# EAGLE design PGTNX05_mainboard (EAGLE 8.5.2)
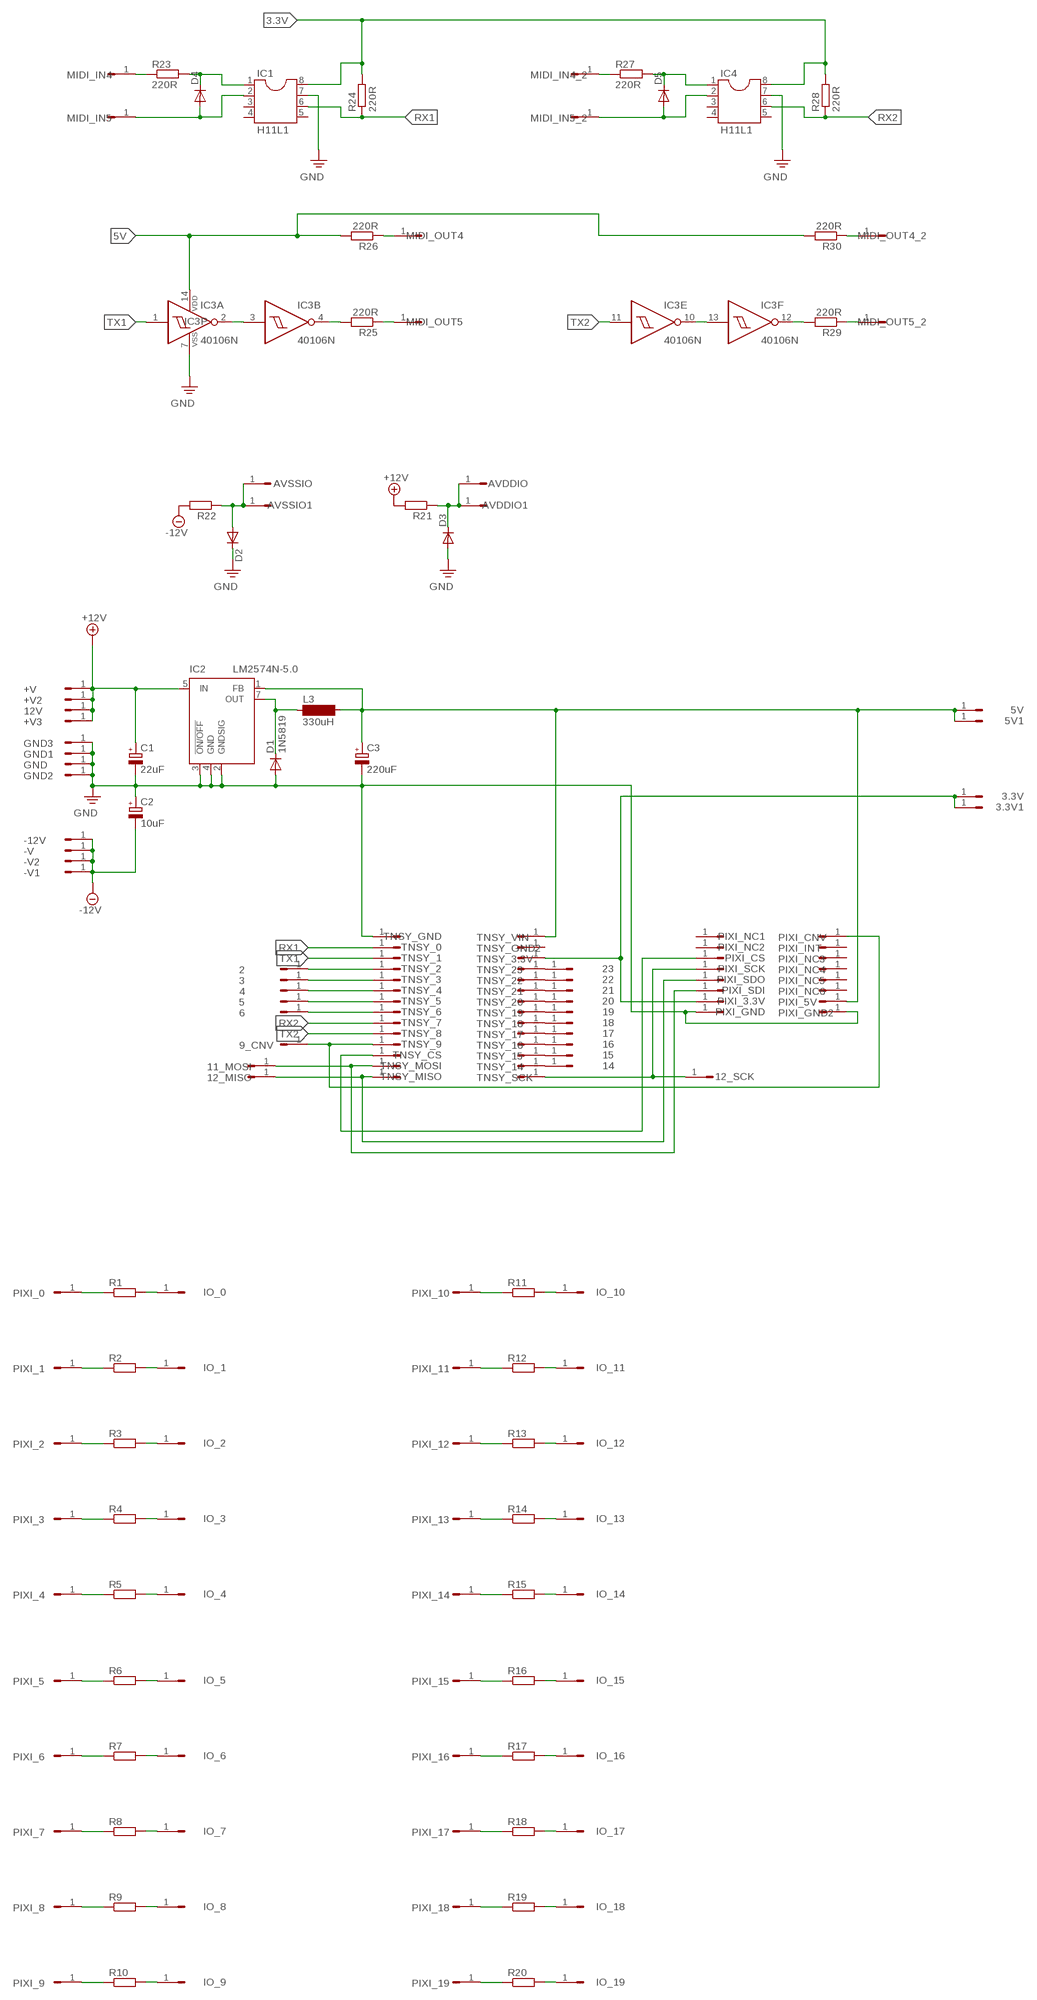
[diagram p0: schematic, sheet 1]

## Parts
2  HEADER/MALE/01  [HEADER/MALE/01]
3  HEADER/MALE/01  [HEADER/MALE/01]
3.3V  HEADER/MALE/01  [HEADER/MALE/01]
3.3V1  HEADER/MALE/01  [HEADER/MALE/01]
4  HEADER/MALE/01  [HEADER/MALE/01]
5  HEADER/MALE/01  [HEADER/MALE/01]
5V  HEADER/MALE/01  [HEADER/MALE/01]
5V1  HEADER/MALE/01  [HEADER/MALE/01]
6  HEADER/MALE/01  [HEADER/MALE/01]
9_CNV  HEADER/MALE/01  [HEADER/MALE/01]
11_MOSI  HEADER/MALE/01  [HEADER/MALE/01]
12_MISO  HEADER/MALE/01  [HEADER/MALE/01]
12_SCK  HEADER/MALE/01  [HEADER/MALE/01]
12V  HEADER/MALE/01  [HEADER/MALE/01]
14  HEADER/MALE/01  [HEADER/MALE/01]
15  HEADER/MALE/01  [HEADER/MALE/01]
16  HEADER/MALE/01  [HEADER/MALE/01]
17  HEADER/MALE/01  [HEADER/MALE/01]
18  HEADER/MALE/01  [HEADER/MALE/01]
19  HEADER/MALE/01  [HEADER/MALE/01]
20  HEADER/MALE/01  [HEADER/MALE/01]
21  HEADER/MALE/01  [HEADER/MALE/01]
22  HEADER/MALE/01  [HEADER/MALE/01]
23  HEADER/MALE/01  [HEADER/MALE/01]
+V  HEADER/MALE/01  [HEADER/MALE/01]
+V2  HEADER/MALE/01  [HEADER/MALE/01]
+V3  HEADER/MALE/01  [HEADER/MALE/01]
-12V  HEADER/MALE/01  [HEADER/MALE/01]
-V  HEADER/MALE/01  [HEADER/MALE/01]
-V1  HEADER/MALE/01  [HEADER/MALE/01]
-V2  HEADER/MALE/01  [HEADER/MALE/01]
AVDDIO  HEADER/MALE/01  [HEADER/MALE/01]
AVDDIO1  HEADER/MALE/01  [HEADER/MALE/01]
AVSSIO  HEADER/MALE/01  [HEADER/MALE/01]
AVSSIO1  HEADER/MALE/01  [HEADER/MALE/01]
C1  22uF  CAPACITOR/POLARIZEDE5-10.5  [E5-10,5]
C2  10uF  CAPACITOR/POLARIZEDE2.5-6  [E2,5-6]
C3  220uF  CAPACITOR/POLARIZEDE2.5-6  [E2,5-6]
D1  1N5819  1N4148DO35-7  [DO35-7]
D2  1N4148DO35-7  [DO35-7]
D3  1N4148DO35-7  [DO35-7]
D4  1N4148DO35-7  [DO35-7]
D5  1N4148DO35-7  [DO35-7]
GND  HEADER/MALE/01  [HEADER/MALE/01]
GND1  HEADER/MALE/01  [HEADER/MALE/01]
GND2  HEADER/MALE/01  [HEADER/MALE/01]
GND3  HEADER/MALE/01  [HEADER/MALE/01]
IC1  H11L1  DIL8  [DIL08]
IC2  LM2574N-5.0  [DIL08]
IC3  40106N  [DIL14]
IC4  H11L1  DIL8  [DIL08]
IO_0  HEADER/MALE/01  [HEADER/MALE/01]
IO_1  HEADER/MALE/01  [HEADER/MALE/01]
IO_2  HEADER/MALE/01  [HEADER/MALE/01]
IO_3  HEADER/MALE/01  [HEADER/MALE/01]
IO_4  HEADER/MALE/01  [HEADER/MALE/01]
IO_5  HEADER/MALE/01  [HEADER/MALE/01]
IO_6  HEADER/MALE/01  [HEADER/MALE/01]
IO_7  HEADER/MALE/01  [HEADER/MALE/01]
IO_8  HEADER/MALE/01  [HEADER/MALE/01]
IO_9  HEADER/MALE/01  [HEADER/MALE/01]
IO_10  HEADER/MALE/01  [HEADER/MALE/01]
IO_11  HEADER/MALE/01  [HEADER/MALE/01]
IO_12  HEADER/MALE/01  [HEADER/MALE/01]
IO_13  HEADER/MALE/01  [HEADER/MALE/01]
IO_14  HEADER/MALE/01  [HEADER/MALE/01]
IO_15  HEADER/MALE/01  [HEADER/MALE/01]
IO_16  HEADER/MALE/01  [HEADER/MALE/01]
IO_17  HEADER/MALE/01  [HEADER/MALE/01]
IO_18  HEADER/MALE/01  [HEADER/MALE/01]
IO_19  HEADER/MALE/01  [HEADER/MALE/01]
L3  330uH  BS11  [BS11]
MIDI_IN4  HEADER/MALE/01  [HEADER/MALE/01]
MIDI_IN4_2  HEADER/MALE/01  [HEADER/MALE/01]
MIDI_IN5  HEADER/MALE/01  [HEADER/MALE/01]
MIDI_IN5_2  HEADER/MALE/01  [HEADER/MALE/01]
MIDI_OUT4  HEADER/MALE/01  [HEADER/MALE/01]
MIDI_OUT4_2  HEADER/MALE/01  [HEADER/MALE/01]
MIDI_OUT5  HEADER/MALE/01  [HEADER/MALE/01]
MIDI_OUT5_2  HEADER/MALE/01  [HEADER/MALE/01]
PIXI_0  HEADER/MALE/01  [HEADER/MALE/01]
PIXI_1  HEADER/MALE/01  [HEADER/MALE/01]
PIXI_2  HEADER/MALE/01  [HEADER/MALE/01]
PIXI_3  HEADER/MALE/01  [HEADER/MALE/01]
PIXI_3.3V  HEADER/MALE/01  [HEADER/MALE/01]
PIXI_4  HEADER/MALE/01  [HEADER/MALE/01]
PIXI_5  HEADER/MALE/01  [HEADER/MALE/01]
PIXI_5V  HEADER/MALE/01  [HEADER/MALE/01]
PIXI_6  HEADER/MALE/01  [HEADER/MALE/01]
PIXI_7  HEADER/MALE/01  [HEADER/MALE/01]
PIXI_8  HEADER/MALE/01  [HEADER/MALE/01]
PIXI_9  HEADER/MALE/01  [HEADER/MALE/01]
PIXI_10  HEADER/MALE/01  [HEADER/MALE/01]
PIXI_11  HEADER/MALE/01  [HEADER/MALE/01]
PIXI_12  HEADER/MALE/01  [HEADER/MALE/01]
PIXI_13  HEADER/MALE/01  [HEADER/MALE/01]
PIXI_14  HEADER/MALE/01  [HEADER/MALE/01]
PIXI_15  HEADER/MALE/01  [HEADER/MALE/01]
PIXI_16  HEADER/MALE/01  [HEADER/MALE/01]
PIXI_17  HEADER/MALE/01  [HEADER/MALE/01]
PIXI_18  HEADER/MALE/01  [HEADER/MALE/01]
PIXI_19  HEADER/MALE/01  [HEADER/MALE/01]
PIXI_CNV  HEADER/MALE/01  [HEADER/MALE/01]
PIXI_CS  HEADER/MALE/01  [HEADER/MALE/01]
PIXI_GND  HEADER/MALE/01  [HEADER/MALE/01]
PIXI_GND2  HEADER/MALE/01  [HEADER/MALE/01]
PIXI_INT  HEADER/MALE/01  [HEADER/MALE/01]
PIXI_NC1  HEADER/MALE/01  [HEADER/MALE/01]
PIXI_NC2  HEADER/MALE/01  [HEADER/MALE/01]
PIXI_NC3  HEADER/MALE/01  [HEADER/MALE/01]
PIXI_NC4  HEADER/MALE/01  [HEADER/MALE/01]
PIXI_NC5  HEADER/MALE/01  [HEADER/MALE/01]
PIXI_NC6  HEADER/MALE/01  [HEADER/MALE/01]
PIXI_SCK  HEADER/MALE/01  [HEADER/MALE/01]
PIXI_SDI  HEADER/MALE/01  [HEADER/MALE/01]
PIXI_SDO  HEADER/MALE/01  [HEADER/MALE/01]
R1  RESISTORRESISTOR/UPRIGHT/7.5  [RESISTOR/7.5]
R2  RESISTORRESISTOR/UPRIGHT/7.5  [RESISTOR/7.5]
R3  RESISTORRESISTOR/UPRIGHT/7.5  [RESISTOR/7.5]
R4  RESISTORRESISTOR/UPRIGHT/7.5  [RESISTOR/7.5]
R5  RESISTORRESISTOR/UPRIGHT/7.5  [RESISTOR/7.5]
R6  RESISTORRESISTOR/UPRIGHT/7.5  [RESISTOR/7.5]
R7  RESISTORRESISTOR/UPRIGHT/7.5  [RESISTOR/7.5]
R8  RESISTORRESISTOR/UPRIGHT/7.5  [RESISTOR/7.5]
R9  RESISTORRESISTOR/UPRIGHT/7.5  [RESISTOR/7.5]
R10  RESISTORRESISTOR/UPRIGHT/7.5  [RESISTOR/7.5]
R11  RESISTORRESISTOR/UPRIGHT/7.5  [RESISTOR/7.5]
R12  RESISTORRESISTOR/UPRIGHT/7.5  [RESISTOR/7.5]
R13  RESISTORRESISTOR/UPRIGHT/7.5  [RESISTOR/7.5]
R14  RESISTORRESISTOR/UPRIGHT/7.5  [RESISTOR/7.5]
R15  RESISTORRESISTOR/UPRIGHT/7.5  [RESISTOR/7.5]
R16  RESISTORRESISTOR/UPRIGHT/7.5  [RESISTOR/7.5]
R17  RESISTORRESISTOR/UPRIGHT/7.5  [RESISTOR/7.5]
R18  RESISTORRESISTOR/UPRIGHT/7.5  [RESISTOR/7.5]
R19  RESISTORRESISTOR/UPRIGHT/7.5  [RESISTOR/7.5]
R20  RESISTORRESISTOR/UPRIGHT/7.5  [RESISTOR/7.5]
R21  RESISTORRESISTOR/UPRIGHT/7.5  [RESISTOR/7.5]
R22  RESISTORRESISTOR/UPRIGHT/7.5  [RESISTOR/7.5]
R23  220R  RESISTORRESISTOR/UPRIGHT/7.5  [RESISTOR/7.5]
R24  220R  RESISTORRESISTOR/UPRIGHT/7.5  [RESISTOR/7.5]
R25  220R  RESISTORRESISTOR/UPRIGHT/7.5  [RESISTOR/7.5]
R26  220R  RESISTORRESISTOR/UPRIGHT/7.5  [RESISTOR/7.5]
R27  220R  RESISTORRESISTOR/UPRIGHT/7.5  [RESISTOR/7.5]
R28  220R  RESISTORRESISTOR/UPRIGHT/7.5  [RESISTOR/7.5]
R29  220R  RESISTORRESISTOR/UPRIGHT/7.5  [RESISTOR/7.5]
R30  220R  RESISTORRESISTOR/UPRIGHT/7.5  [RESISTOR/7.5]
TNSY_0  HEADER/MALE/01  [HEADER/MALE/01]
TNSY_1  HEADER/MALE/01  [HEADER/MALE/01]
TNSY_2  HEADER/MALE/01  [HEADER/MALE/01]
TNSY_3  HEADER/MALE/01  [HEADER/MALE/01]
TNSY_3.3V  HEADER/MALE/01  [HEADER/MALE/01]
TNSY_4  HEADER/MALE/01  [HEADER/MALE/01]
TNSY_5  HEADER/MALE/01  [HEADER/MALE/01]
TNSY_6  HEADER/MALE/01  [HEADER/MALE/01]
TNSY_7  HEADER/MALE/01  [HEADER/MALE/01]
TNSY_8  HEADER/MALE/01  [HEADER/MALE/01]
TNSY_9  HEADER/MALE/01  [HEADER/MALE/01]
TNSY_14  HEADER/MALE/01  [HEADER/MALE/01]
TNSY_15  HEADER/MALE/01  [HEADER/MALE/01]
TNSY_16  HEADER/MALE/01  [HEADER/MALE/01]
TNSY_17  HEADER/MALE/01  [HEADER/MALE/01]
TNSY_18  HEADER/MALE/01  [HEADER/MALE/01]
TNSY_19  HEADER/MALE/01  [HEADER/MALE/01]
TNSY_20  HEADER/MALE/01  [HEADER/MALE/01]
TNSY_21  HEADER/MALE/01  [HEADER/MALE/01]
TNSY_22  HEADER/MALE/01  [HEADER/MALE/01]
TNSY_23  HEADER/MALE/01  [HEADER/MALE/01]
TNSY_CS  HEADER/MALE/01  [HEADER/MALE/01]
TNSY_GND  HEADER/MALE/01  [HEADER/MALE/01]
TNSY_GND2  HEADER/MALE/01  [HEADER/MALE/01]
TNSY_MISO  HEADER/MALE/01  [HEADER/MALE/01]
TNSY_MOSI  HEADER/MALE/01  [HEADER/MALE/01]
TNSY_SCK  HEADER/MALE/01  [HEADER/MALE/01]
TNSY_VIN  HEADER/MALE/01  [HEADER/MALE/01]

## Nets
3.3V: 3.3V1.1 3.3V.1 IC1.8 IC4.8 PIXI_3.3V.1 R24.2 R28.2 TNSY_3.3V.1
5V: 5V1.1 5V.1 C3.+ IC2.1(FB) IC3.14(P:VDD) L3.2 PIXI_5V.1 R26.2 R30.2 TNSY_VIN.1
+12V: 12V.1 +V2.1 +V3.1 +V.1 C1.+ IC2.5(IN) R21.2
-12V: -12V.1 -V1.1 -V2.1 -V.1 C2.- R22.2
GND: C1.- C2.+ C3.- D1.A D2.C D3.A GND1.1 GND2.1 GND3.1 GND.1 IC1.7 IC2.2(GNDSIG) IC2.3(!ON/OFF) IC2.4(GND) IC3.7(P:VSS) IC4.7 PIXI_GND2.1 PIXI_GND.1 TNSY_GND.1
N$2: 17.1 TNSY_17.1
N$4: 16.1 TNSY_16.1
N$5: D1.C IC2.7(OUT) L3.1
N$6: 12_MISO.1 PIXI_SDO.1 TNSY_MISO.1
N$8: PIXI_CS.1 TNSY_CS.1
N$11: 18.1 TNSY_18.1
N$12: 19.1 TNSY_19.1
N$13: 20.1 TNSY_20.1
N$14: 21.1 TNSY_21.1
N$15: 22.1 TNSY_22.1
N$16: 23.1 TNSY_23.1
N$18: 15.1 TNSY_15.1
N$19: 2.1 TNSY_2.1
N$20: 3.1 TNSY_3.1
N$21: 4.1 TNSY_4.1
N$22: 5.1 TNSY_5.1
N$23: PIXI_0.1 R1.1
N$24: IO_0.1 R1.2
N$25: PIXI_1.1 R2.1
N$26: 6.1 TNSY_6.1
N$27: IO_1.1 R2.2
N$28: 9_CNV.1 PIXI_CNV.1 TNSY_9.1
N$29: 11_MOSI.1 PIXI_SDI.1 TNSY_MOSI.1
N$30: PIXI_2.1 R3.1
N$31: 12_SCK.1 PIXI_SCK.1 TNSY_SCK.1
N$32: 14.1 TNSY_14.1
N$33: IO_2.1 R3.2
N$34: PIXI_3.1 R4.1
N$35: IO_3.1 R4.2
N$36: PIXI_4.1 R5.1
N$37: IO_4.1 R5.2
N$38: PIXI_5.1 R6.1
N$39: IO_5.1 R6.2
N$40: PIXI_6.1 R7.1
N$41: IO_6.1 R7.2
N$42: PIXI_7.1 R8.1
N$43: IO_7.1 R8.2
N$44: PIXI_8.1 R9.1
N$45: IO_8.1 R9.2
N$46: PIXI_9.1 R10.1
N$47: IO_9.1 R10.2
N$48: PIXI_10.1 R11.1
N$49: IO_10.1 R11.2
N$50: PIXI_11.1 R12.1
N$51: IO_11.1 R12.2
N$52: PIXI_12.1 R13.1
N$53: IO_12.1 R13.2
N$54: PIXI_13.1 R14.1
N$55: IO_13.1 R14.2
N$56: PIXI_14.1 R15.1
N$57: IO_14.1 R15.2
N$58: PIXI_15.1 R16.1
N$59: IO_15.1 R16.2
N$60: PIXI_16.1 R17.1
N$61: IO_16.1 R17.2
N$62: PIXI_17.1 R18.1
N$63: IO_17.1 R18.2
N$64: PIXI_18.1 R19.1
N$65: IO_18.1 R19.2
N$66: AVDDIO1.1 AVDDIO.1 D3.C R21.1
N$67: AVSSIO1.1 AVSSIO.1 D2.A R22.1
N$68: PIXI_19.1 R20.1
N$69: IO_19.1 R20.2
N$70: MIDI_IN4.1 R23.1
N$71: D4.C IC1.1 R23.2
N$72: D4.A IC1.2 MIDI_IN5.1
N$75: IC3.2(A:O) IC3.3(B:I)
N$76: IC3.4(B:O) R25.2
N$77: MIDI_OUT5.1 R25.1
N$78: MIDI_OUT4.1 R26.1
N$79: MIDI_IN4_2.1 R27.1
N$80: D5.C IC4.1 R27.2
N$81: D5.A IC4.2 MIDI_IN5_2.1
N$85: IC3.10(E:O) IC3.13(F:I)
N$86: IC3.12(F:O) R29.2
N$87: MIDI_OUT5_2.1 R29.1
N$89: MIDI_OUT4_2.1 R30.1
RX1: IC1.6 R24.1 TNSY_0.1
RX2: IC4.6 R28.1 TNSY_7.1
TX1: IC3.1(A:I) TNSY_1.1
TX2: IC3.11(E:I) TNSY_8.1
Unconnected: IC1.3 IC1.4 IC1.5 IC3.5(C:I) IC3.6(C:O) IC3.8(D:O) IC3.9(D:I) IC4.3 IC4.4 IC4.5 PIXI_INT.1 PIXI_NC1.1 PIXI_NC2.1 PIXI_NC3.1 PIXI_NC4.1 PIXI_NC5.1 PIXI_NC6.1 TNSY_GND2.1

## Library data of the parts
2 3 3.3V 3.3V1 4 5 5V 5V1 6 9_CNV 11_MOSI 12_MISO 12_SCK 12V 14-23 +V +V2 +V3 -12V -V -V1 -V2 AVDDIO AVDDIO1 AVSSIO AVSSIO1 GND GND1-GND3 IO_0 IO_1-IO_19 MIDI_IN4 MIDI_IN4_2 MIDI_IN5 MIDI_IN5_2 MIDI_OUT4 MIDI_OUT4_2 MIDI_OUT5 MIDI_OUT5_2 PIXI_0 PIXI_1-PIXI_3 PIXI_3.3V PIXI_4 PIXI_5 PIXI_5V PIXI_6-PIXI_19 PIXI_CNV PIXI_CS PIXI_GND PIXI_GND2 PIXI_INT PIXI_NC1-PIXI_NC6 PIXI_SCK PIXI_SDI PIXI_SDO TNSY_0 TNSY_1-TNSY_3 TNSY_3.3V TNSY_4-TNSY_9 TNSY_14-TNSY_23 TNSY_CS TNSY_GND TNSY_GND2 TNSY_MISO TNSY_MOSI TNSY_SCK TNSY_VIN = connectors:HEADER/MALE/01; SPICEPREFIX: X
C1-C3 = capacitors:CAPACITOR/POLARIZED: POLARIZED CAPACITOR, European symbol; SPICEPREFIX: C
D1-D5 = transistors:1N4148: DIODE high speed (Philips)
IC1 IC4 = ic_package:DIL8: Dual In Line / Socket
IC2 = linear:LM2574?-*: SIMPLE SWITCHER 0.5A Step-Down Voltage Regulator Source: http://cache.national.com/ds/LM/LM2574.pdf
IC3 = 40xx:40106: Hex SCHMITT TRIGGER
L3 = inductor-neosid:BS: INDUCTOR nominal inductance, magnetically screened; OC_FARNELL: unknown; OC_NEWARK: unknown
R1-R30 = resistors:RESISTOR: RESISTOR, European symbol

## Board
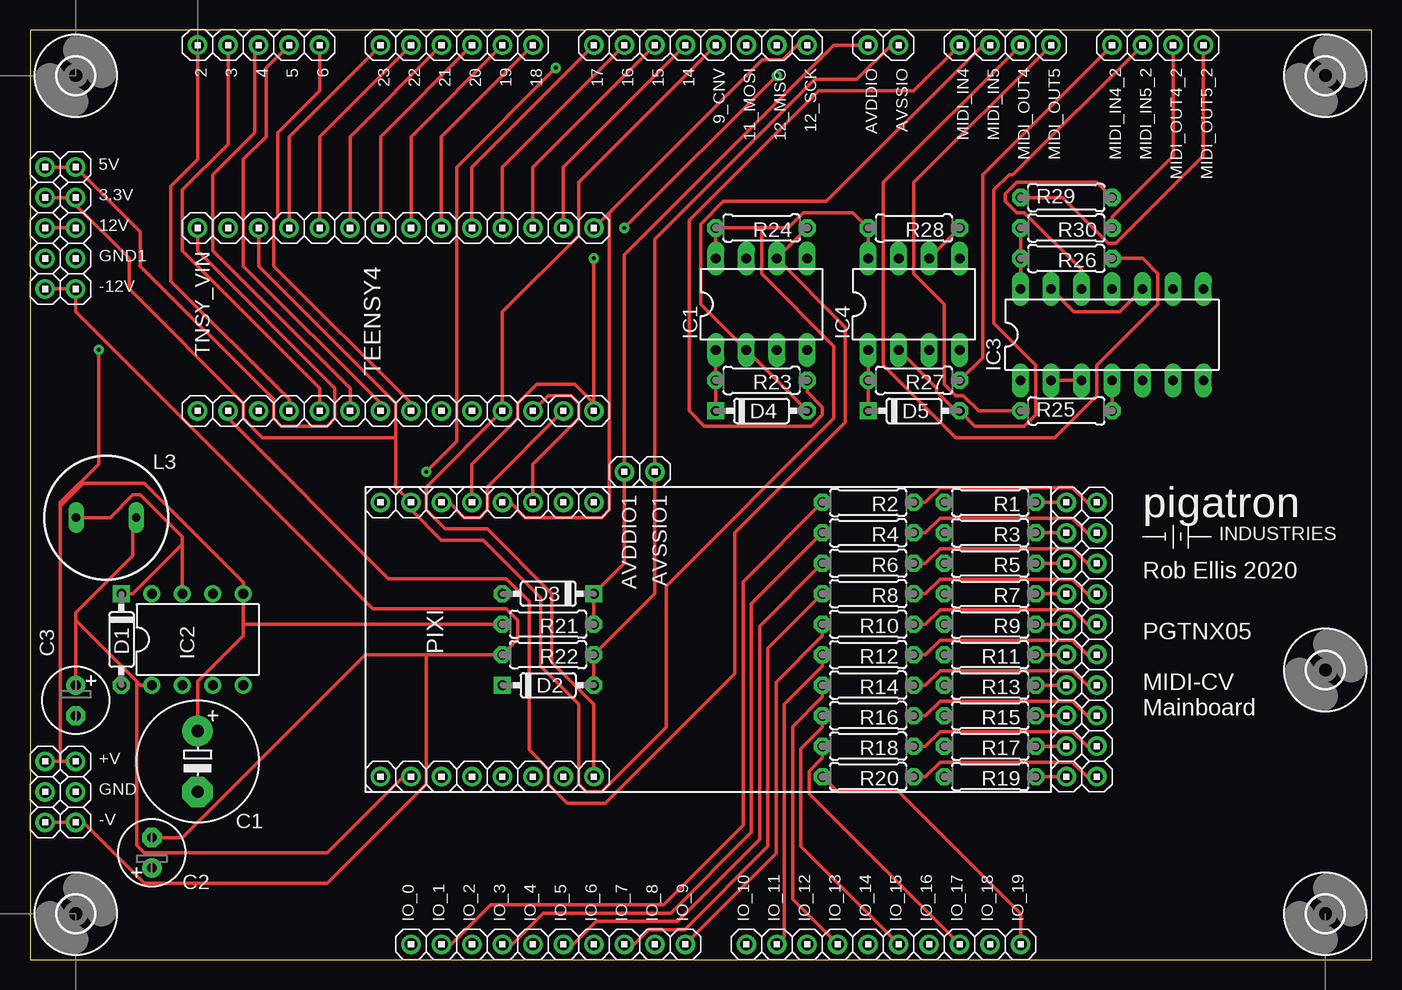
[diagram p1: board, top side]
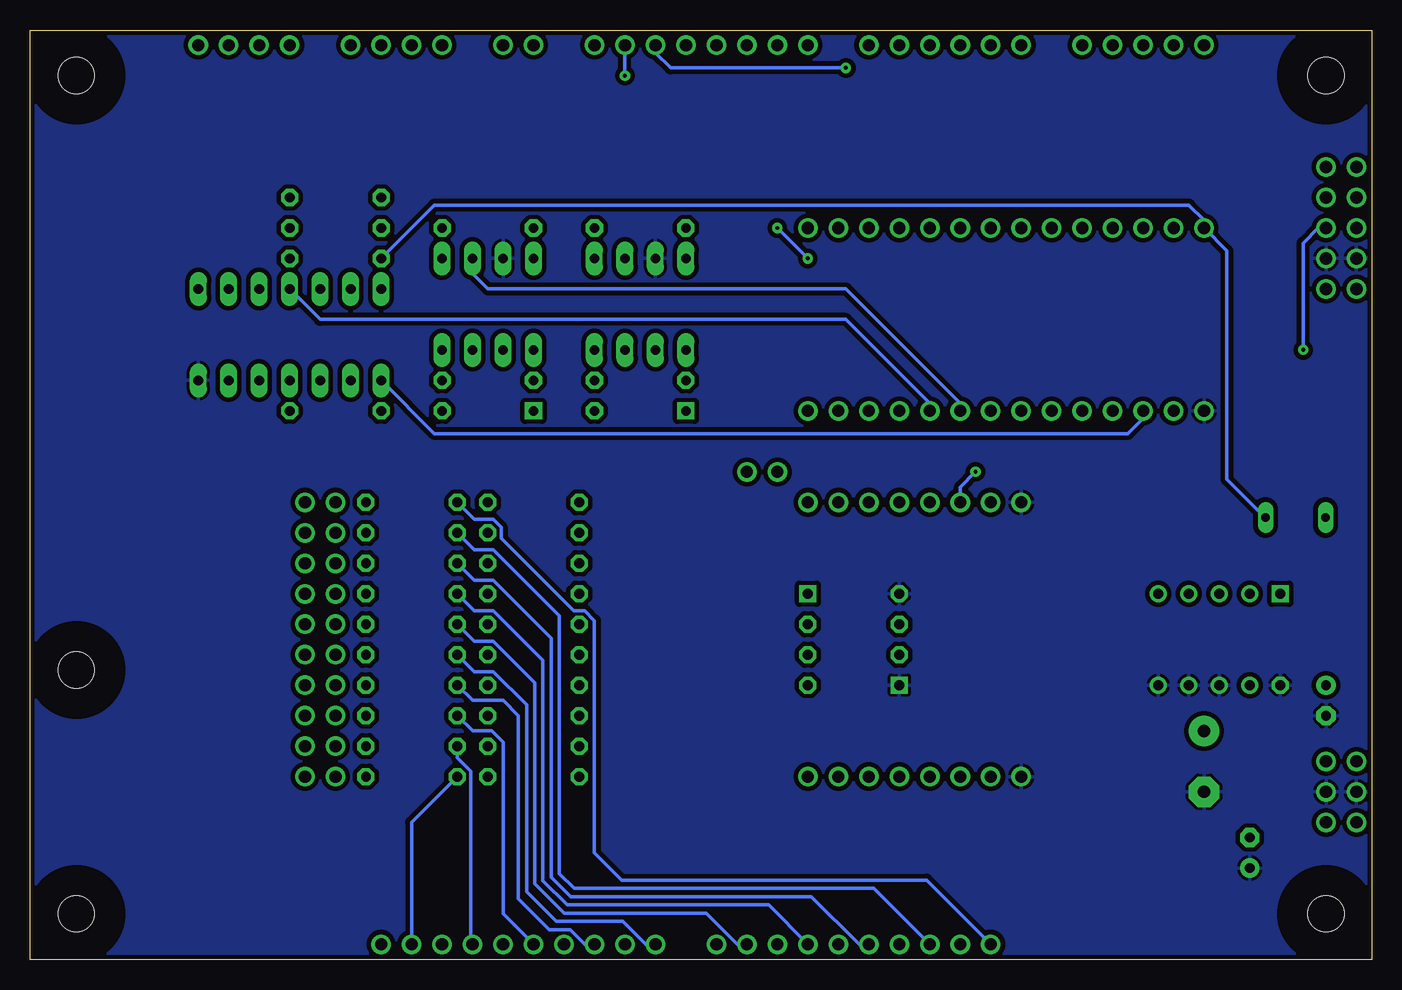
[diagram p2: board, bottom side, seen from below]

Size 111.81 x 77.46 mm. Coordinates in mm from the lower left corner, seen from the top.
Outline: 0,0 111.81,0 111.81,77.46 0,77.46 0,0
Copper layers (1*16): Top 0.0356mm / dielectric 1.5011mm / Bottom 0.0356mm
Design rules "pigatron": minimum track width 12mil, minimum drill 13mil, track to track 15mil, track to pad 10mil, pad to pad 10mil, via to via 10mil, smd to smd 6mil, copper to edge 15mil, drill to drill 10mil, minimum pad ring 12mil, minimum via ring 10mil, stop-mask expansion 4mil, vias tented up to drill 0mil, thermal gap 10mil

### Footprints (pad centres in the part's own frame; a part is rotated, then mirrored left to right if it is on the bottom)
HEADER/MALE/01 = drill 1.016: 1 0,0
E5-10,5 = drill 1.016 pad 2.54: + -2.54,0 | drill 1.016 pad 2.54 octagon: - 2.54,0
E2,5-6 = drill 0.813 pad 1.6: + -1.27,0 | drill 0.813 pad 1.6 octagon: - 1.27,0
DO35-7 = drill 0.813 octagon: A 3.81,0 | drill 0.813 square: C -3.81,0
DIL08 = drill 0.813 long: 1 -3.81,-3.81; 2 -1.27,-3.81; 3 1.27,-3.81; 4 3.81,-3.81; 5 3.81,3.81; 6 1.27,3.81; 7 -1.27,3.81; 8 -3.81,3.81
DIL08' = drill 0.813 pad 1.27: 1 -3.81,-3.81; 2 -1.27,-3.81; 3 1.27,-3.81; 4 3.81,-3.81; 5 3.81,3.81; 6 1.27,3.81; 7 -1.27,3.81; 8 -3.81,3.81
DIL14 = drill 0.813 long: 1 -7.62,-3.81; 2 -5.08,-3.81; 3 -2.54,-3.81; 4 0,-3.81; 5 2.54,-3.81; 6 5.08,-3.81; 7 7.62,-3.81; 8 7.62,3.81; 9 5.08,3.81; 10 2.54,3.81; 11 0,3.81; 12 -2.54,3.81; 13 -5.08,3.81; 14 -7.62,3.81
BS11 = drill 0.7 long: 1 -2.5,0; 2 2.5,0
RESISTOR/7.5 = drill 0.813 octagon: 1 -3.81,0; 2 3.81,0
STANDOFF/3.0 = hole 3: 0,0

### Placement (x,y rotation side)
2  13.97,76.2 270 top
3  16.51,76.2 270 top
3.3V  3.81,63.5 0 top
3.3V1  1.27,63.5 0 top
4  19.05,76.2 270 top
5  21.59,76.2 270 top
5V  3.81,66.04 0 top
5V1  1.27,66.04 0 top
6  24.13,76.2 270 top
9_CNV  57.15,76.2 270 top
11_MOSI  59.69,76.2 270 top
12_MISO  62.23,76.2 270 top
12_SCK  64.77,76.2 270 top
12V  3.81,60.96 0 top
14  54.61,76.2 270 top
15  52.07,76.2 270 top
16  49.53,76.2 270 top
17  46.99,76.2 270 top
18  41.91,76.2 270 top
19  39.37,76.2 270 top
20  36.83,76.2 270 top
21  34.29,76.2 270 top
22  31.75,76.2 270 top
23  29.21,76.2 270 top
+V  3.81,16.51 0 top
+V2  1.27,16.51 0 top
+V3  1.27,60.96 0 top
-12V  3.81,55.88 0 top
-V  3.81,11.43 0 top
-V1  1.27,55.88 0 top
-V2  1.27,11.43 0 top
AVDDIO  69.85,76.2 270 top
AVDDIO1  49.53,40.64 270 top
AVSSIO  72.39,76.2 270 top
AVSSIO1  52.07,40.64 270 top
C1  13.97,16.51 270 top
C2  10.16,8.89 90 top
C3  3.81,21.59 270 top
D1  7.62,26.67 270 top
D2  43.18,22.86 0 top
D3  43.18,30.48 180 top
D4  60.96,45.72 0 top
D5  73.66,45.72 0 top
GND  3.81,13.97 0 top
GND1  3.81,58.42 0 top
GND2  1.27,13.97 0 top
GND3  1.27,58.42 0 top
IC1  60.96,54.61 0 top
IC2  LM2574N-5.0  [DIL08']  13.97,26.67 0 top
IC3  90.17,52.07 0 top
IC4  73.66,54.61 0 top
IO_0  31.75,1.27 90 top
IO_1  34.29,1.27 90 top
IO_2  36.83,1.27 90 top
IO_3  39.37,1.27 90 top
IO_4  41.91,1.27 90 top
IO_5  44.45,1.27 90 top
IO_6  46.99,1.27 90 top
IO_7  49.53,1.27 90 top
IO_8  52.07,1.27 90 top
IO_9  54.61,1.27 90 top
IO_10  59.69,1.27 90 top
IO_11  62.23,1.27 90 top
IO_12  64.77,1.27 90 top
IO_13  67.31,1.27 90 top
IO_14  69.85,1.27 90 top
IO_15  72.39,1.27 90 top
IO_16  74.93,1.27 90 top
IO_17  77.47,1.27 90 top
IO_18  80.01,1.27 90 top
IO_19  82.55,1.27 90 top
L3  6.35,36.83 0 top
MIDI_IN4  77.47,76.2 270 top
MIDI_IN4_2  90.17,76.2 270 top
MIDI_IN5  80.01,76.2 270 top
MIDI_IN5_2  92.71,76.2 270 top
MIDI_OUT4  82.55,76.2 270 top
MIDI_OUT4_2  95.25,76.2 270 top
MIDI_OUT5  85.09,76.2 270 top
MIDI_OUT5_2  97.79,76.2 270 top
PIXI_0  86.36,38.1 180 top
PIXI_1  88.9,38.1 0 top
PIXI_2  86.36,35.56 180 top
PIXI_3  88.9,35.56 0 top
PIXI_3.3V  31.75,38.1 270 top
PIXI_4  86.36,33.02 180 top
PIXI_5  88.9,33.02 0 top
PIXI_5V  31.75,15.24 90 top
PIXI_6  86.36,30.48 180 top
PIXI_7  88.9,30.48 0 top
PIXI_8  86.36,27.94 180 top
PIXI_9  88.9,27.94 0 top
PIXI_10  86.36,25.4 180 top
PIXI_11  88.9,25.4 0 top
PIXI_12  86.36,22.86 180 top
PIXI_13  88.9,22.86 0 top
PIXI_14  86.36,20.32 180 top
PIXI_15  88.9,20.32 0 top
PIXI_16  86.36,17.78 180 top
PIXI_17  88.9,17.78 0 top
PIXI_18  86.36,15.24 180 top
PIXI_19  88.9,15.24 0 top
PIXI_CNV  46.99,15.24 90 top
PIXI_CS  41.91,38.1 270 top
PIXI_GND  29.21,38.1 270 top
PIXI_GND2  29.21,15.24 90 top
PIXI_INT  44.45,15.24 90 top
PIXI_NC1  46.99,38.1 270 top
PIXI_NC2  44.45,38.1 270 top
PIXI_NC3  41.91,15.24 90 top
PIXI_NC4  39.37,15.24 90 top
PIXI_NC5  36.83,15.24 90 top
PIXI_NC6  34.29,15.24 90 top
PIXI_SCK  39.37,38.1 270 top
PIXI_SDI  34.29,38.1 270 top
PIXI_SDO  36.83,38.1 270 top
R1  80.01,38.1 180 top
R2  69.85,38.1 180 top
R3  80.01,35.56 180 top
R4  69.85,35.56 180 top
R5  80.01,33.02 180 top
R6  69.85,33.02 180 top
R7  80.01,30.48 180 top
R8  69.85,30.48 180 top
R9  80.01,27.94 180 top
R10  69.85,27.94 180 top
R11  80.01,25.4 180 top
R12  69.85,25.4 180 top
R13  80.01,22.86 180 top
R14  69.85,22.86 180 top
R15  80.01,20.32 180 top
R16  69.85,20.32 180 top
R17  80.01,17.78 180 top
R18  69.85,17.78 180 top
R19  80.01,15.24 180 top
R20  69.85,15.24 180 top
R21  43.18,27.94 180 top
R22  43.18,25.4 180 top
R23  60.96,48.26 180 top
R24  60.96,60.96 180 top
R25  86.36,45.72 0 top
R26  86.36,58.42 180 top
R27  73.66,48.26 180 top
R28  73.66,60.96 180 top
R29  86.36,63.5 0 top
R30  86.36,60.96 180 top
TNSY_0  16.51,45.72 90 top
TNSY_1  19.05,45.72 90 top
TNSY_2  21.59,45.72 90 top
TNSY_3  24.13,45.72 90 top
TNSY_3.3V  19.05,60.96 90 top
TNSY_4  26.67,45.72 90 top
TNSY_5  29.21,45.72 90 top
TNSY_6  31.75,45.72 90 top
TNSY_7  34.29,45.72 90 top
TNSY_8  36.83,45.72 90 top
TNSY_9  39.37,45.72 90 top
TNSY_14  44.45,60.96 90 top
TNSY_15  41.91,60.96 90 top
TNSY_16  39.37,60.96 90 top
TNSY_17  36.83,60.96 90 top
TNSY_18  34.29,60.96 90 top
TNSY_19  31.75,60.96 90 top
TNSY_20  29.21,60.96 90 top
TNSY_21  26.67,60.96 90 top
TNSY_22  24.13,60.96 90 top
TNSY_23  21.59,60.96 90 top
TNSY_CS  41.91,45.72 90 top
TNSY_GND  13.97,45.72 90 top
TNSY_GND2  16.51,60.96 90 top
TNSY_MISO  46.99,45.72 90 top
TNSY_MOSI  44.45,45.72 90 top
TNSY_SCK  46.99,60.96 90 top
TNSY_VIN  13.97,60.96 270 top
U$1  [STANDOFF/3.0]  107.95,24.13 0 top
U$2  [STANDOFF/3.0]  3.81,73.66 0 top
U$3  [STANDOFF/3.0]  107.95,73.66 0 top
U$4  [STANDOFF/3.0]  107.95,3.81 0 top
U$5  [PIGATRON-LOGO]  101.6,36.83 0 top
U$7  [STANDOFF/3.0]  3.81,3.81 0 top

### Tracks (layer width: path | path; a pad name or v marks a point on that pad's centre or on a via)
3.3V
  Top 0.305: IC1.8 R24.2 60.96,60.96 | IC4.8 R28.2 68.58,62.23 64.45,62.23 63.18,60.96 60.96,60.96 | 3.3V1.1 3.3V.1 3.81,62.87 8.26,58.42 8.26,55.88 17.78,46.35 17.78,45.09 19.37,43.5 30.48,43.5 | TNSY_3.3V.1 19.05,57.78 30.48,46.35 30.48,43.5 | 30.48,43.5 30.48,39.37 PIXI_3.3V.1 31.75,37.47 34.29,34.92 37.78,34.92 42.55,30.16 42.55,24.45 45.72,21.27 45.72,14.61 46.35,13.97 47.62,13.97 53.02,19.37 53.02,31.11 66.99,45.09 66.99,51.12 60.96,57.15 60.96,60.96
5V
  Top 0.305: IC3.14 R26.2 R30.2 | 5V1.1 5V.1 9.21,60.64 9.21,57.78 20.32,46.67 20.32,45.09 20.95,44.45 24.77,44.45 25.4,45.09 25.4,47.62 13.97,59.05 TNSY_VIN.1 | C3.+ 3.81,28.26 | 3.81,28.26 3.81,28.89 8.57,33.66 8.57,36.83 L3.2 | IC2.1 9.21,22.86 8.89,23.18 | 3.81,28.26 8.89,23.18 | PIXI_5V.1 31.11,15.24 24.77,8.89 9.53,8.89 8.89,9.53 8.89,23.18
  Bottom 0.305: R26.2 78.11,62.87 15.24,62.87 13.97,61.59 TNSY_VIN.1 12.06,59.05 12.06,40.01 8.89,36.83 L3.2
+12V  (via drill 0.33)
  Top 0.305: 12V.1 +V3.1 | +V.1 2.54,16.51 | 2.54,16.51 +V2.1 | 17.78,27.94 17.78,26.99 13.97,23.18 C1.+ | 17.78,27.94 IC2.5 17.78,31.43 9.53,39.69 4.45,39.69 2.54,37.78 | 17.78,27.94 R21.2 | 2.54,37.78 2.54,37.47 2.54,16.51 | v5.71,50.8 5.71,41.27 2.54,38.1 2.54,37.78
  Bottom 0.305: 12V.1 4.45,60.96 5.71,59.69 v5.71,50.8
-12V
  Top 0.305: -V1.1 -12V.1 3.81,53.98 28.57,29.21 39.69,29.21 40.64,28.26 40.64,26.67 R22.2 33.02,25.4 | -V2.1 -V.1 4.45,11.43 9.53,6.35 24.77,6.35 33.02,14.61 33.02,25.4 | 33.02,25.4 27.94,25.4 12.7,10.16 C2.-
GND
  pour Bottom: 0,77.47 111.76,77.47 111.76,0 0,0
N$2
  Top 0.305: 17.1 36.83,66.04 TNSY_17.1
N$4
  Top 0.305: 16.1 39.37,66.04 TNSY_16.1
N$5
  Top 0.305: L3.1 6.67,36.83 8.57,38.73 9.21,38.73 12.7,35.24 12.7,34.61 | IC2.7 12.7,34.61 | D1.C 8.57,30.48 12.7,34.61
N$6  (via drill 0.33)
  Top 0.305: PIXI_SDO.1 36.83,41.27 40.64,45.09 40.64,46.35 42.23,47.94 45.4,47.94 46.99,46.35 | v49.53,60.96 v62.23,73.66 | 46.99,46.35 v46.99,58.42 | 46.99,46.35 TNSY_MISO.1
  Bottom 0.305: v62.23,73.66 12_MISO.1 | v46.99,58.42 v49.53,60.96
N$8
  Top 0.305: PIXI_CS.1 41.91,41.27 45.72,45.09 45.72,46.35 45.09,46.99 43.18,46.99 TNSY_CS.1
N$11
  Top 0.305: 18.1 34.29,68.58 TNSY_18.1
N$12
  Top 0.305: 19.1 31.75,68.58 TNSY_19.1
N$13
  Top 0.305: 20.1 29.21,68.58 TNSY_20.1
N$14
  Top 0.305: 21.1 26.67,68.58 TNSY_21.1
N$15
  Top 0.305: 22.1 24.13,68.58 TNSY_22.1
N$16
  Top 0.305: 23.1 21.59,68.58 TNSY_23.1
N$18
  Top 0.305: 15.1 41.91,66.04 TNSY_15.1
N$19
  Top 0.305: 2.1 13.97,66.67 11.75,64.45 11.75,56.52 21.59,46.67 TNSY_2.1
N$20
  Top 0.305: TNSY_3.1 24.13,47.62 12.7,59.05 12.7,64.14 16.51,67.94 3.1
N$21
  Top 0.305: TNSY_4.1 26.67,47.62 15.24,59.05 15.24,65.41 18.73,68.9 18.73,75.88 4.1
N$22
  Top 0.305: TNSY_5.1 29.21,46.35 17.78,57.78 17.78,66.67 19.68,68.58 19.68,74.3 5.1
N$23
  Top 0.305: PIXI_0.1 R1.1
N$24
  Bottom 0.305: R1.2 74.78,36.68 73.2,36.68 72.54,36.02 72.54,35.1 66.5,29.06 65.58,29.06 64.77,28.25 64.77,8.89 62.49,6.61 37.09,6.61 IO_0.1
N$25
  Top 0.305: R2.1 74.62,38.1 75.84,39.32 86.86,39.32 88.08,38.1 PIXI_1.1
N$26
  Top 0.305: 6.1 24.13,72.39 20.64,68.9 20.64,61.91 20.32,61.59 20.32,57.78 31.75,46.35 TNSY_6.1
N$27
  Top 0.305: R2.2 59.44,31.5 59.44,11.18 52.81,4.55 38.38,4.55 35.11,1.27 IO_1.1
N$28
  Top 0.305: 9_CNV.1 45.72,64.77 45.72,60.33 39.37,53.98 TNSY_9.1 33.02,39.37 33.02,37.47 34.61,35.88 38.1,35.88 43.5,30.48 43.5,24.77 46.99,21.27 PIXI_CNV.1
N$29  (via drill 0.33)
  Top 0.305: PIXI_SDI.1 34.92,38.1 36.2,36.83 37.47,36.83 38.1,37.47 38.1,39.37 TNSY_MOSI.1 | v43.81,74.3 35.56,66.04 35.56,43.18 v33.02,40.64
  Bottom 0.305: 11_MOSI.1 59.69,75.56 58.42,74.3 v43.81,74.3 | v33.02,40.64 34.29,39.37 PIXI_SDI.1
N$30
  Top 0.305: R3.1 PIXI_2.1
N$31
  Top 0.305: TNSY_SCK.1 48.26,62.23 | 48.26,62.23 61.01,74.98 62.73,74.98 63.95,76.2 12_SCK.1 | PIXI_SCK.1 40.01,38.1 41.27,36.83 47.62,36.83 48.26,37.47 48.26,62.23
N$32
  Top 0.305: 14.1 44.45,66.04 TNSY_14.1
N$33
  Bottom 0.305: R3.2 74.78,34.14 73.2,34.14 67.69,28.63 67.69,7.15 66.47,5.92 41.48,5.92 IO_2.1
N$34
  Top 0.305: R4.1 74.62,35.56 75.84,36.78 86.86,36.78 88.08,35.56 PIXI_3.1
N$35
  Top 0.305: R4.2 60.12,29.64 60.12,10.59 53.39,3.86 42.78,3.86 40.19,1.27 IO_3.1
N$36
  Top 0.305: PIXI_4.1 R5.1
N$37
  Bottom 0.305: R5.2 74.78,31.6 73.2,31.6 68.38,26.78 68.38,6.87 66.74,5.23 46.69,5.23 42.73,1.27 IO_4.1
N$38
  Top 0.305: R6.1 74.62,33.02 75.84,34.24 86.86,34.24 88.08,33.02 PIXI_5.1
N$39
  Top 0.305: R6.2 60.81,27.79 60.81,10.01 53.98,3.17 47.17,3.17 45.27,1.27 IO_5.1
N$40
  Top 0.305: R7.1 PIXI_6.1
N$41
  Bottom 0.305: R7.2 74.78,29.06 73.2,29.06 69.06,24.92 69.06,6.58 67.03,4.55 50.27,4.55 IO_6.1
N$42
  Top 0.305: R8.1 74.62,30.48 75.84,31.7 86.86,31.7 88.08,30.48 PIXI_7.1
N$43
  Top 0.305: R8.2 61.49,25.93 61.49,9.42 54.56,2.49 51.56,2.49 50.35,1.27 IO_7.1
N$44
  Top 0.305: PIXI_8.1 R9.1
N$45
  Bottom 0.305: R9.2 74.78,26.52 73.2,26.52 69.75,23.07 69.75,6.3 67.31,3.86 55.48,3.86 52.89,1.27 IO_8.1
N$46
  Top 0.305: R10.1 74.62,27.94 75.84,29.16 86.86,29.16 88.08,27.94 PIXI_9.1
N$47
  Top 0.305: IO_9.1 62.18,8.84 62.18,23.12 66.04,26.98 R10.2
N$48
  Top 0.305: R11.1 PIXI_10.1
N$49
  Bottom 0.305: R11.2 74.78,23.98 73.2,23.98 70.43,21.21 70.43,5.66 67.94,3.17 62.41,3.17 60.51,1.27 IO_10.1
N$50
  Top 0.305: R12.1 74.62,25.4 75.84,26.62 86.86,26.62 88.08,25.4 PIXI_11.1
N$51
  Top 0.305: R12.2 66.04,24.44 62.87,21.27 62.87,1.91 IO_11.1
N$52
  Top 0.305: PIXI_12.1 R13.1
N$53
  Bottom 0.305: R13.2 74.93,21.59 72.39,21.59 71.12,20.32 71.12,5.08 68.53,2.49 66.81,2.49 65.59,1.27 IO_12.1
N$54
  Top 0.305: R14.1 74.62,22.86 75.84,24.08 86.86,24.08 88.08,22.86 PIXI_13.1
N$55
  Top 0.305: R14.2 66.04,21.9 63.55,19.41 63.55,5.03 IO_13.1
N$56
  Top 0.305: R15.1 PIXI_14.1
N$57
  Bottom 0.305: R15.2 74.93,19.05 73.35,19.05 72.39,18.09 72.39,3.81 IO_14.1
N$58
  Top 0.305: R16.1 74.62,20.32 75.84,21.54 86.86,21.54 88.08,20.32 PIXI_15.1
N$59
  Top 0.305: R16.2 66.04,19.36 64.24,17.56 64.24,9.42 IO_15.1
N$60
  Top 0.305: PIXI_16.1 R17.1
N$61
  Bottom 0.305: R17.2 76.2,16.82 75.08,15.7 75.08,1.42 IO_16.1
N$62
  Top 0.305: R18.1 74.62,17.78 75.84,19 86.86,19 88.08,17.78 PIXI_17.1
N$63
  Top 0.305: R18.2 66.04,16.82 64.92,15.7 64.92,13.82 IO_17.1
N$64
  Top 0.305: R19.1 PIXI_18.1
N$65
  Bottom 0.305: R19.2 80.01,11.43 IO_18.1
N$66
  Top 0.305: R21.1 D3.C 49.53,33.02 AVDDIO1.1 49.53,58.74 66.99,76.2 AVDDIO.1
N$67
  Top 0.305: D2.A R22.1 52.07,30.48 AVSSIO1.1 52.07,60.01 65.41,73.34 68.9,73.34 71.75,76.2 AVSSIO.1
N$68
  Top 0.305: R20.1 74.62,15.24 75.84,16.46 86.86,16.46 88.08,15.24 PIXI_19.1
N$69
  Top 0.305: R20.2 67.31,13.97 72.39,13.97 82.55,3.81 IO_19.1
N$70
  Top 0.305: R23.1 64.77,47.31 66.04,46.04 66.04,45.4 65.09,44.45 56.2,44.45 54.93,45.72 54.93,61.59 65.72,72.39 73.66,72.39 MIDI_IN4.1
N$71
  Top 0.305: D4.C R23.2 IC1.1
N$72
  Top 0.305: D4.A IC1.2 55.88,54.61 55.88,61.28 57.78,63.18 66.36,63.18 79.38,76.2 MIDI_IN5.1
N$75
  Top 0.305: IC3.3 IC3.2
N$76
  Top 0.305: IC3.4 R25.2
N$77
  Top 0.305: R25.1 79.06,45.72 77.79,46.99 77.15,46.99 76.2,47.94 76.2,54.61 73.66,57.15 73.66,64.77 MIDI_OUT5.1
N$78
  Top 0.305: R26.1 92.71,58.42 93.98,57.15 93.98,54.61 88.9,49.53 88.9,46.99 85.41,43.5 77.15,43.5 71.12,49.53 71.12,64.77 MIDI_OUT4.1
N$79
  Top 0.305: R27.1 79.38,50.16 79.38,65.41 MIDI_IN4_2.1
N$80
  Top 0.305: D5.C R27.2 IC4.1
N$81
  Top 0.305: IC4.2 75.56,47.62 75.56,47.31 77.15,45.72 D5.A 78.74,44.45 82.87,44.45 83.82,45.4 83.82,49.53 80.33,53.02 80.33,64.14 81.6,65.41 81.92,65.41 MIDI_IN5_2.1
N$85
  Top 0.305: IC3.13 87,53.98 90.81,53.98 IC3.10
N$86
  Top 0.305: IC3.12 87.63,57.47 82.87,62.23 82.23,62.23 81.28,63.18 81.28,63.82 82.23,64.77 88.9,64.77 R29.2
N$87
  Top 0.305: R29.1 86.04,63.5 89.85,59.69 90.49,59.69 97.79,66.99 MIDI_OUT5_2.1
N$89
  Top 0.305: R30.1 90.17,61.91 95.25,66.99 MIDI_OUT4_2.1
RX1
  Top 0.305: R24.1 IC1.6 67.94,52.7 67.94,44.77 58.74,35.56 58.74,23.81 47.94,13.02 44.77,13.02 43.18,14.61 43.18,15.88 41.59,17.46 41.59,29.84 39.69,31.75 29.84,31.75 16.51,45.09 TNSY_0.1
RX2
  Top 0.305: R28.1 IC4.6
  Bottom 0.305: TNSY_7.1 34.29,46.35 43.81,55.88 73.66,55.88 74.93,57.15 IC4.6
TX1
  Bottom 0.305: IC3.1 78.11,43.81 20.32,43.81 19.05,45.09 TNSY_1.1
TX2
  Bottom 0.305: IC3.11 87.63,53.34 43.81,53.34 36.83,46.35 TNSY_8.1

### Text on the board
tNames: TEENSY4 | Rob Ellis 2020 | PIXI | PGTNX05 | MIDI-CV / Mainboard